# Altium project Window_Garden.PrjPcb
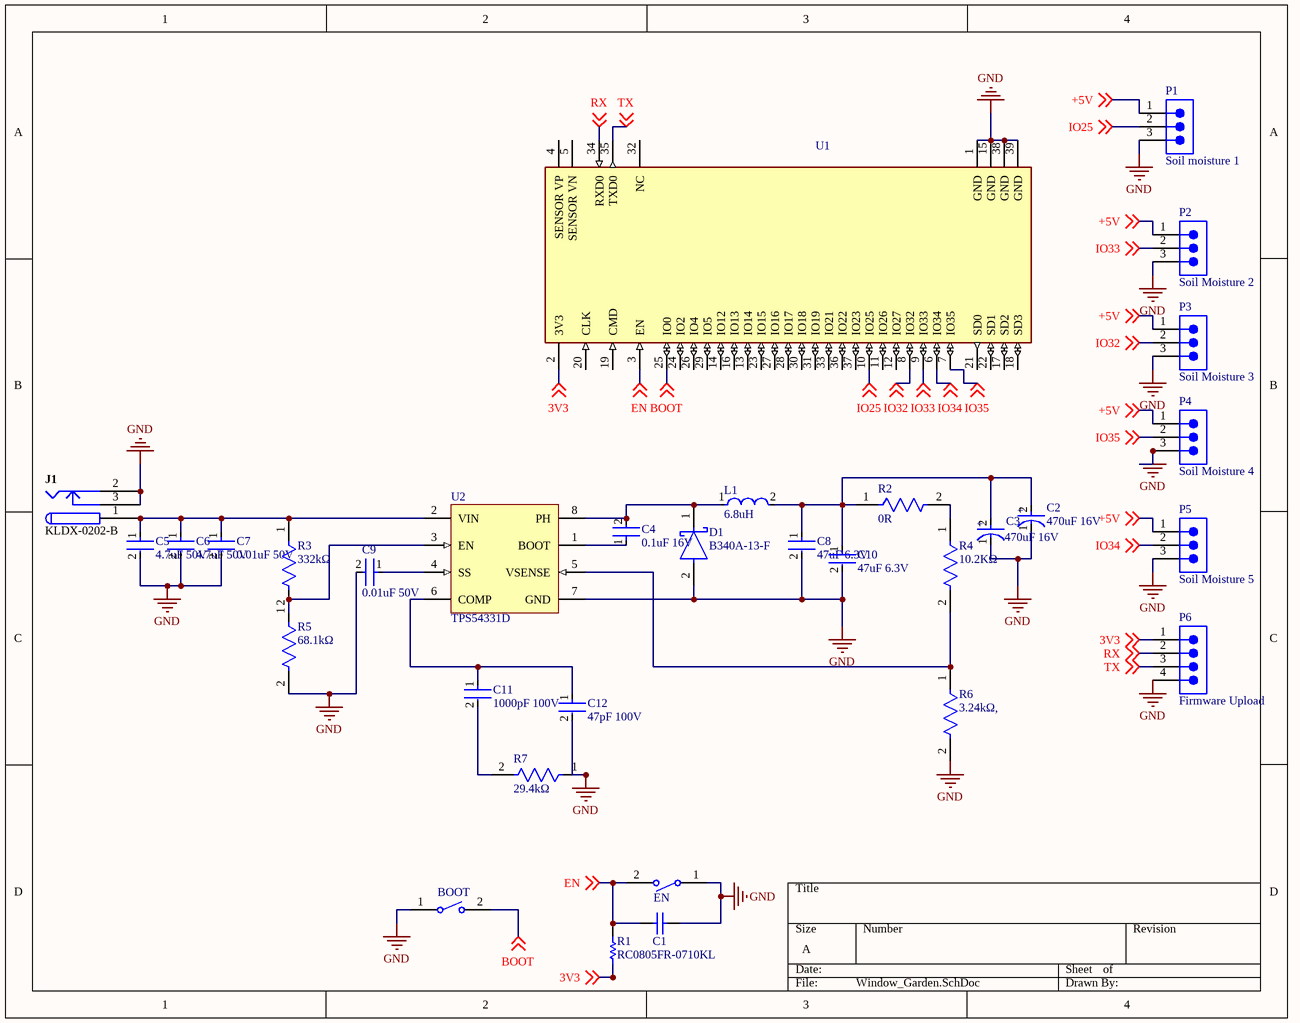
[diagram p0: Window_Garden.SchDoc]
1 sheet, 32 parts. Net scope: global (net labels, ports and power ports of the same name join across sheets).
Board file: Window_Garden.PcbDoc

## Sheet Window_Garden.SchDoc
size A; SheetNumber: 1; SheetTotal: 1

### Parts
BOOT  FSMSMTR  [TECO-FSMSMTR_V]  (value not drawn)
C1  GRM188R71H104KA93D  [CAPC1608X90X35ML10T15]  (value not drawn)
C2  470uF 16V  [FP-RAD-TH-D_8_0_5-L_11_5-MFG]
C3  470uF 16V  [FP-RAD-TH-D_8_0_5-L_11_5-MFG]
C4  0.1uF 16V  [FP-C0805C-DN-MFG]
C5  4.7uF 50V  [FP-C1206C475K5PACTU-MFG]
C6  4.7uF 50V  [FP-C1206C475K5PACTU-MFG]
C7  0.01uF 50V  [FP-C1206C-EB-MFG]
C8  47uF 6.3V  [FP-CL31-IPC_C]
C9  0.01uF 50V  [FP-C1206C-EB-MFG]
C10  47uF 6.3V  [FP-CL31-IPC_C]
C11  1000pF 100V  [FP-C0805C-DN-MFG]
C12  47pF 100V  [FP-C0805C-DN-MFG]
D1  B340A-13-F  [FP-SMA-MFG]
EN  FSMSMTR  [TECO-FSMSMTR_V]  (value not drawn)
J1  KLDX-0202-B  [KYCN-KLDX-0202-B_V]
L1  6.8uH  [FP-NR8040-H_4_2-MFG]
P1  Soil moisture 1  [691312510003]
P2  Soil Moisture 2  [691312510003]
P3  Soil Moisture 3  [691312510003]
P4  Soil Moisture 4  [691312510003]
P5  Soil Moisture 5  [691312510003]
P6  Firmware Upload  [61300411121]
R1  RC0805FR-0710KL  [RESC2013X60X35NL10T20]
R2  0R  [FP-CRCW1206-MFG]
R3  332kΩ  [FP-RMCF1206-IPC_A]
R4  10.2KΩ  [FP-RP732B-MFG]
R5  68.1kΩ  [FP-RNCP1206-MFG]
R6  3.24kΩ,  [FP-RG3216-IPC_A]
R7  29.4kΩ  [FP-MCR18-MFG]
U1  ESP32-WROOM-32D (16MB)  [FP-ESP32-WROOM-32D_16MB-MFG]  (value not drawn)
U2  TPS54331D  [D0008A_L]

### Nets
GND: BOOT.1 C1.1 C2.1(C) C3.1(C) C5.2 C6.2 C7.2 C8.2 C9.2 C10.2 C12.2 D1.2(A) EN.1 J1.2 J1.3 P1.3 P2.3 P3.3 P4.3 P5.3 P6.4 R5.2 R6.2 R7.1 U1.1(GND) U1.15(GND) U1.38(GND) U1.39(GND) U2.7(GND)
3V3: P6.1 R1.1 U1.2(3V3) ; off-sheet 3V3
+5V: P1.1 P2.1 P3.1 P4.1 P5.1 ; off-sheet +5V
BOOT: BOOT.2 U1.25(IO0) ; off-sheet BOOT
EN: C1.2 EN.2 R1.2 U1.3(EN) ; off-sheet EN
IO25: P1.2 U1.10(IO25) ; off-sheet IO25
IO32: P3.2 U1.8(IO32) ; off-sheet IO32
IO33: P2.2 U1.9(IO33) ; off-sheet IO33
IO34: P5.2 U1.6(IO34) ; off-sheet IO34
IO35: P4.2 U1.7(IO35) ; off-sheet IO35
RX: P6.2 U1.34(RXD0) ; off-sheet RX
TX: P6.3 U1.35(TXD0) ; off-sheet TX
NetC2_2: C2.2(A) C3.2(A) C8.1 C10.1 L1.2 R2.1
NetC4_1: C4.1 U2.1(BOOT)
NetC4_2: C4.2 D1.1(C) L1.1 U2.8(PH)
NetC5_1: C5.1 C6.1 C7.1 J1.1 R3.1 U2.2(VIN)
NetC9_1: C9.1 U2.4(SS)
NetC11_1: C11.1 C12.1 U2.6(COMP)
NetC11_2: C11.2 R7.2
NetR2_2: R2.2 R4.1
NetR3_2: R3.2 R5.1 U2.3(EN)
NetR4_2: R4.2 R6.1 U2.5(VSENSE)

Not connected (* = marked no-connect by the designer): U1 4(SENSOR_VP) 5(SENSOR_VN) 11(IO26) 12(IO27) 13(IO14) 14(IO12) 16(IO13) 17(SD2) 18(SD3) 19(CMD) 20(CLK) 21(SD0) 22(SD1) 23(IO15) 24(IO2) 26(IO4) 27(IO16) 28(IO17) 29(IO5) 30(IO18) 31(IO19) 32(NC) 33(IO21) 36(IO22) 37(IO23)

### Notes on the sheet
- (in symbol CMP-05427-001287-1) +

### Library data of the parts
BOOT EN = CMP-2000-07501-1: FSMSM Push Button Switch, 50 mA, -35 to 85 degC, 2-Pin SMD, RoHS, Tape and Reel; Manufacturer: TE Connectivity; Voltage Rating (DC): 24V; Electrical Life: 20000Cycles; Operating Force: 180gf; Switch Travel: 0.25mm; Contact Current Rating: 50mA; Case\/Package: SMD/SMT; Actuator Length: 1.07mm; Throw Configuration: SPST; Actuator Material: Polyamide; Contact Resistance: 100mOhm; Illumination Type: Illuminated; Max Voltage Rating (DC): 12V; Manufacturer URL: http://www.te.com/; Lead Free: LeadFree; Packaging: TapeandReel; Min Operating Temperature: -35degC; Mechanical Life: 20000Cycles; Mount: SurfaceMount; REACH SVHC: Unknown; Package Quantity: 1800; Package Reference: FSMSMTR; RoHSCompliant: true; Max Operating Temperature: 85degC; Orientation: Straight; ELV: Compliant; Datasheet URL: http://www.te.com/commerce/DocumentDelivery/DDEController?Action=showdoc&DocId=Customer+Drawing%7F1437566-3%7FC2%7Fpdf%7FEnglish%7FENG_CD_1437566-3_C2_1437566_3_1_c.dwg.pdf%7F1437566-4; Package Description: 2-Pin Surface Mount Device, Body 6 x 3.5 mm, Pitch 9.19 mm; Current Rating: 50mA; Contact Plating: Silver; Termination: GullWing; Datasheet Version: Rev. C2, 08/2014; Contact Material: Brass; Mounting Technology: SurfaceMount
C1 = CMP-2100-03643-1: Chip Capacitor, 0.1 uF, +/- 10%, 50 V, -55 to 125 degC, 0603 (1608 Metric), RoHS, Tape and Reel; Manufacturer: Murata; Dielectric Material: Ceramic; Voltage Rating: 50V; Capacitance: 100nF; Dielectric: X7R; Insulation Resistance: 10GR; Case Code (Metric): 1608; Lead Free: LeadFree; Depth: 0.8mm; Number of Pins: 2; Radiation Hardening: No; Case/Package: 0603; Manufacturer URL: http://www.murata.com/; Packaging: TapeandReel; Length: 1.6mm; Contact Plating: Tin; Datasheet URL: http://psearch.en.murata.com/capacitor/product/GRM188R71H104KA93%23.pdf; Tolerance: 10%; Case Code (Imperial): 0603; Min Operating Temperature: -55degC; RoHSCompliant: true; Voltage: 50V; Termination: SMD/SMT; Mount: SurfaceMount; Material: Ceramic; Package Quantity: 1; Height: 0.8mm; Thickness: 0.035inch; REACH SVHC: NoSVHC; Max Operating Temperature: 125degC; Width: 0.8mm; Package Reference: 0603; Voltage Rating (DC): 50V; Datasheet Version: 42675.0; Package Description: 2-Pin Surface Mount Device, Body 1.6 x 0.8 mm
C2 C3 = CMP-05427-001287-1: Aluminum Electrolytic Capacitors (Radial Lead Type) 470uF ±20% 16V; Life (Hours): 6000Hour; Lead Diameter: 0.6mm; Ripple Current: 950mA; Impedance: 56mR; Voltage Rating: 16V; Features: General Purpose; Capacitance: 470uF; Max Operating Temperature: 105°C; RoHS Compliant: Yes; Mount: Through Hole; Termination: Radial; Voltage Rating (DC): 16V; Series: FR; Case/Package: Radial; Radiation Hardening: No; Diameter: 8mm; Lead Free: Lead Free; Height - Seated (Max): 0.512inch; Lead Pitch: 5mm; Tolerance: 20%; Height: 11.5mm; ESR (Equivalent Series Resistance): 56mR; Packaging: Ammo Pack; Length: 11.5mm; Package Quantity: 1; Min Operating Temperature: -40°C; REACH SVHC: No SVHC
C4 = CMP-2007-00274-2: CAP CER 0.1UF 16V X7R 0805; Manufacturer Part Number: C0805C104K4RACTU; Manufacturer: KEMET; Material: Ceramic; Tolerance: 0.1; Capacitance: 0.10 μF; Value: 0.10 μF; Temperature Coefficient: 30ppm/°C; Device Class L3: Ceramic Capacitors; RoHS: TRUE; Octopart: https://octopart.com/c0805c104k4ractu-kemet-92155; ComponentLink2Description: Datasheet; ComponentLink2URL: https://content.kemet.com/datasheets/KEM_C1003_C0G_SMD.pdf; Temperature Range High: +125°C; Category: Cap; Lead Free: Yes; Digikey Description: CAP CER 0.1UF 16V X7R 0805; Automotive: No; Temperature Range Low: -55°C; Voltage Rating: 16 V; Package: C0805C-DN; Ipc Land Pattern Name: CAPC200125X78; Height: 0.88mm; Device Class L1: Passive Components; Temperature: -55°C to +125°C; Mouser Description: Multilayer Ceramic Capacitors MLCC - SMD/SMT 16volts 0.1uF X7R 10%; Device Class L2: Capacitors; Temperature Characteristic: X7R
C5 C6 = CMP-03020-034652-1: CAP CER 4.7UF 50V X5R 1206; Dielectric Material: Ceramic; Tolerance: 10%; Mount: Surface Mount; Number of Pins: 2; Capacitance: 4.7uF; Contact Plating: Tin; Radiation Hardening: No; Lead Free: Lead Free; Length: 3.2mm; Depth: 1.6mm; Min Operating Temperature: -55°C; Max Operating Temperature: 85°C; Voltage: 50V; Construction: Flat; Packaging: Tape and Reel; Termination: SMD/SMT; Height: 1.6mm; Voltage Rating (DC): 50V; Dielectric: X5R; Case/Package: 1206
C7 C9 = CMP-2000-06008-2: CAP CER 10000PF 50V X7R 1206; Manufacturer: KEMET; Manufacturer Part Number: C1206C103K5RACTU; Material: Ceramic; Temperature Coefficient: 15%; Capacitance: 10,000 pF; Automotive Grade: Grade 0; Value: 10,000 pF; Tolerance: 0.1; Height: 0.88mm; Digikey Description: CAP CER 10000PF 50V X7R 1206; Temperature Range Low: -55°C; Temperature: -55°C to +150°C; Temperature Range High: +150°C; Automotive: Yes; RoHS: TRUE; Lead Free: Yes; Device Class L3: Ceramic Capacitors; Device Class L2: Capacitors; Device Class L1: Passive Components; Octopart: https://octopart.com/c1206c103k5ractu-kemet-130245; Category: Cap; ComponentLink2Description: Datasheet; Mouser Description: Multilayer Ceramic Capacitors MLCC - SMD/SMT 50volts 10000pF X7R 10%; ComponentLink2URL: https://content.kemet.com/datasheets/KEM_C1007_X8R_ULTRA_150C_SMD.pdf; Voltage Rating: 50 V; Package: C1206C-EB; Temperature Characteristic: X7R; Ipc Land Pattern Name: CAPC320160X78
C8 C10 = CMP-13271-001061-1: Cap Ceramic 47uF 6.3V X5R ±20% SMD 1206 +85°C Embossed T/R; Tolerance: 20%; Capacitance: 47uF; Depth: 1.6mm; Case Code (Imperial): 1206; Voltage Rating: 6.3V; Width: 0.063inch; Max Operating Temperature: 85°C; Case/Package: 1206; Dielectric: X5R; Length: 3.2mm; Contact Plating: Tin; Height: 1.6mm; Packaging: Tape and Reel; Case Code (Metric): 3216; Voltage: 6.3V; Min Operating Temperature: -55°C; Mount: Surface Mount; Thickness: 0.071inch; Package Quantity: 1; Material: Ceramic; Radiation Hardening: No
C11 = CMP-03020-024313-1: CAP CER 1000PF 100V X7R 0805; Manufacturer Part Number: C0805C102K1RACTU; Manufacturer: KEMET; Capacitance: 1,000 pF; Value: 1,000 pF; Tolerance: 0.1; Material: Ceramic; Temperature Coefficient: 30ppm/°C; ComponentLink2URL: https://content.kemet.com/datasheets/KEM_C1003_C0G_SMD.pdf; Digikey Description: CAP CER 1000PF 100V X7R 0805; Device Class L3: Ceramic Capacitors; Automotive: No; Ipc Land Pattern Name: CAPC200125X78; Temperature: -55°C to +125°C; Lead Free: Yes; Temperature Characteristic: X7R; Device Class L2: Capacitors; Temperature Range High: +125°C; Voltage Rating: 100 V; Octopart: https://octopart.com/c0805c102k1ractu-kemet-148516; RoHS: TRUE; Mouser Description: Multilayer Ceramic Capacitors MLCC - SMD/SMT 100volts 1000pF X7R 10%; Category: Cap; ComponentLink2Description: Datasheet; Height: 0.88mm; Device Class L1: Passive Components; Temperature Range Low: -55°C; Package: C0805C-DN
C12 = CMP-1036-01631-3: CAP CER 47PF 100V 5% NP0 0805; Manufacturer: KEMET; Manufacturer Part Number: C0805C470J1GACTU; Temperature Characteristic: C0G; Material: Ceramic; Temperature Coefficient: 30ppm/°C; Tolerance: 0.05; Value: 47 pF; Device Class L3: Ceramic Capacitors; Package: C0805C-DN; Category: Cap; ComponentLink2URL: https://content.kemet.com/datasheets/KEM_C1003_C0G_SMD.pdf; Ipc Land Pattern Name: CAPC200125X78; Temperature Range Low: -55°C; Temperature: -55°C to +125°C; Temperature Range High: +125°C; Device Class L2: Capacitors; Height: 0.88mm; Octopart: https://octopart.com/c0805c470j1gactu-kemet-9138638; Digikey Description: CAP CER 47PF 100V 5% NP0 0805; Lead Free: Yes; Voltage Rating: 100 V; Device Class L1: Passive Components; Capacitance: 47 pF; Mouser Description: Capacitor: ceramic; MLCC; 47pF; 100V; C0G; ±5%; SMD; 0805; RoHS: TRUE; ComponentLink2Description: Datasheet; Automotive: No
D1 = CMP-1667-00003-3: DIODE SCHOTTKY 40V 3A SMA; Max Forward Surge Current (Ifsm): 80A; Forward Voltage: 500mV; Polarity: Standard; Max Reverse Current: 500uA; Capacitance: 250pF; Element Configuration: Single; Mount: Surface Mount; Output Current: 3A; Radiation Hardening: No; Width: 2.92mm; Current Rating: 3A; Termination: SMD/SMT; Voltage: 40V; Series: -; Max Operating Temperature: 125°C; Current: 3A; Max Repetitive Reverse Voltage (Vrrm): 40V; Min Operating Temperature: -55°C; REACH SVHC: No SVHC; Number of Pins: 2; Average Rectified Current: 3A; Contact Plating: Tin; RoHS Compliant: Yes; Max Reverse Voltage (DC): 40V; Packaging: Tape and Reel; Height: 2.3mm; Length: 4.6mm; Case/Package: SMA; Weight: 0.002258oz; Peak Non-Repetitive Surge Current: 80A; Package Quantity: 5000; Lead Free: Lead Free; Forward Current: 3A; Voltage Rating (DC): 40V
J1 = CMP-0256-00001-1: 3 Conductor Power Jack, 2 break 2 aux contacts; ComponentLink2URL: http://anacapa.kycon.com/Catalog_PDF/KLDX_0202.pdf; PackageReference: KLDX-0202-B; Contact Finish: Brass; ComponentLink2Description: Datasheet; Mounting Technology: Through Hole; PackageDescription: Jack, 9 x 14.5 mm Body, 2.5 mm Center Pin Diameter; ComponentLink1Description: Manufacturer URL; PartNumber: KLDX-0202-B; ComponentLink1URL: http://kycon.com/
L1 = CMP-14484-000783-1: Shielded Wirewound Inductor 6.8uH 30% 4.4A 32.5mΩ SMD; DC Resistance (DCR): 32.5mR; Core Material: Ferrite; Test Frequency: 100kHz; Self Resonant Frequency: 24MHz; RMS Current (Irms): 3.7A; Height: 4.2mm; RoHS Compliant: Yes; Saturation Current: 4.4A; Termination: SMD/SMT; Packaging: Tape and Reel; Lead Pitch: 5.6mm; Inductance Tolerance: 30%; Height - Seated (Max): 0.157inch; Max DC Current: 4.4A; Package Quantity: 1000; Radiation Hardening: No; Length: 8mm; Shielding: Shielded; Depth: 8.2mm; Tolerance: 30%; Current Rating: 3.7A; Resistor Type: Wirewound; Series: NRS; Halogen Free: Halogen Free; Inductance: 6.8uH; Mount: Surface Mount; Lead Free: Lead Free; Width: 0.315inch; Min Operating Temperature: -25°C; Case/Package: 8040; Max Operating Temperature: 125°C; Number of Pins: 2
P1-P5 = CMP-1502-02170-2: NexarPartId: 8917754; Gender: Male; Number of Levels: 1; Voltage: 300V; Number of Contacts: 3; Pitch: 5.08mm; Current: 20A; Color: Green; Length: 11.5mm; Height: 12mm; Contact Plating: Tin; Mount: Through Hole; Width: 15.24mm; Number of Rows: 1; Number of Pins: 3; Termination: Solder; RoHS: Compliant; Packaging: Box; REACH SVHC: Unknown; Contact Material: Brass; Lead Pitch: 5.08mm; Number of Positions Per Level: 3
P6 = CMP-1502-01064-3: NexarPartId: 32855522; Operating Supply Voltage: 250V; Pitch: 2.54mm; Contact Resistance: 20mΩ; Number of Positions: 4; Current Rating: 3A; Connector Type: Male Pin; Gender: Male; Contact Plating: Gold; Height: 8.89mm; Lead Pitch: 2.54mm; Lead Free: Lead Free; Contact Mating Length: 5.9944mm; Number of Rows: 1; Termination: Solder; Packaging: Bulk; REACH SVHC: Unknown; Min Operating Temperature: -40°C; RoHS: Compliant; Number of Contacts: 4; Voltage Rating: 250V; Color: Black; Max Operating Temperature: 105°C; Contact Material: Copper; Mount: Through Hole; Orientation: Vertical; Number of Pins: 4
R1 = CMP-1659-00013-4: Chip Resistor, 10 KOhm, +/- 1%, 0.125 W, -55 to 155 degC, 0805 (2012 Metric), RoHS, Tape and Reel; Manufacturer: Yageo; Voltage Rating: 150 V; Mount: Surface Mount; ComponentLink1Description: Manufacturer URL; ComponentLink2URL: http://www.yageo.com/documents/recent/PYu-RC_Group_51_RoHS_L_04.pdf; Pins: 2; Length: 2 mm; Min Operating Temperature: -55 degC; Height: 0.5 mm; Mounting Technology: Surface Mount; RoHSCompliant: true; REACH SVHC: No SVHC; ComponentLink1URL: http://www.yageo.com/; Max Operating Temperature: 155 degC; PackageReference: 0805; DatasheetVersion: Rev. 4, 02/2016; Package Quantity: 5000; Packaging: Tape and Reel; ComponentLink2Description: Datasheet; PackageDescription: 2-Pin Surface Mounted Device, Body 2 x 1.25 mm
R2 = CMP-00030-39388935-1: CRCW12060000ZSTA Zero Ohm Resistor, Jumper, 1206 [3216 Metric], Thick Film, 250 mW, Surface Mount; Voltage Rating (DC): 200V; Max Power Dissipation: 250mW; Temperature Coefficient: 100ppm/°C; Resistance: 0Ω; Packaging: Cut Tape; Lead Free: Contains Lead; Height: 609.6µm; Military Standard: Not; Min Operating Temperature: -55°C; Weight: 10.007382mg; Depth: 1.6mm; Termination: SMD/SMT; Mount: Surface Mount; RoHS: Compliant; Case Code (Metric): 3216; Max Operating Temperature: 155°C; NexarPartId: 39388935; Length: 3.2mm; Features: Automotive AEC-Q200; Case Code (Imperial): 1206; Composition: Thick Film; Case/Package: 1206; Voltage Rating: 200V; Width: 1.6mm; Contact Plating: Lead, Tin; Number of Terminations: 2; REACH SVHC: Unknown; Power Rating: 250mW; Radiation Hardening: No
R3 = CMP-26527-005507-1: 332kΩ ±1% 0.25W 1206 Thick Film Chip Resistor AEC-Q200 compliant; Resistance: 332kR; Temperature Coefficient: 100ppm/°C; Max Power Dissipation: 250mW; Tolerance: 1%; Case Code (Imperial): 1206; Radiation Hardening: No; RoHS Compliant: Yes; Resistor Type: Thick Film; Height: 0.028inch; Contact Plating: Tin; Case Code (Metric): 3216; Number of Terminations: 2; Length: 0.126inch; Case/Package: 1206; Min Operating Temperature: -55°C; Packaging: Tape and Reel; Max Operating Temperature: 155°C; Mount: Surface Mount; Package Quantity: 1; Width: 0.063inch; Series: RMCF; Features: Automotive AEC-Q200
R4 = CMP-03211-006303-1: Res Thin Film 1206 10.2KΩ 0.1% 0.25W 15ppm/°C Molded SMD; Manufacturer Part Number: RP73D2B10K2BTG; Manufacturer: TE Connectivity; Voltage Rating: 200V; Height: 0.65mm; Power Rating: 0.25W; Temperature: -55°C to 155°C; ComponentLink2Description: Datasheet; Resistance: 10.2KΩ; Automotive: No; ComponentLink2URL: https://www.te.com/commerce/DocumentDelivery/DDEController?Action=showdoc&DocId=Data+Sheet%7F1773272%7FL%7Fpdf%7FEnglish%7FENG_DS_1773272_L.pdf%7F8-1879255-6; Lead Free: Yes; RoHS: TRUE; Temperature Range Low: -55°C; Ipc Land Pattern Name: RESC305155X55; Temperature Coefficient: 15ppm/°C; Device Class L3: Chip SMD Resistors; Temperature Range High: 155°C; Value: 10.2KΩ; packaging: 250 cut tape length; Category: Res; Series: RP73; Octopart: https://octopart.com/rp73d2b10k2btg-te+connectivity-42013012; Device Class L1: Passive Components; Tolerance: 0.1%; Package: RP732B; octopart_url: https://octopart.com/rp73d2b10k2btg-te+connectivity-42013012; Composition: Thin Film; Device Class L2: Resistors
R5 = CMP-26527-004608-1: 68.1kΩ ±1% 0.5W 1206 High Power Anti-Sulfur Thin Film Chip Resistor; Temperature Coefficient: 100ppm/°C; Max Power Dissipation: 500mW; Resistance: 68.1kR; Number of Terminations: 2; Case/Package: 1206; Mount: Surface Mount; Max Operating Temperature: 155°C; Case Code (Metric): 3216; Height: 0.024inch; Resistor Type: Thin Film; Case Code (Imperial): 1206; Tolerance: 1%; Length: 0.122inch; Width: 0.059inch; Series: RNCP; Features: Moisture Resistant; Packaging: Cut Tape; Min Operating Temperature: -55°C; RoHS Compliant: Yes
R6 = CMP-28537-006634-1: Automotive Metal Thin Film Chip Resistor, 1206, 3.24kΩ, 0.1%, 5ppm/°C, 0.25W, 200V; Resistance: 3.24kR; Power Rating: 125mW; Max Power Dissipation: 250mW; Voltage Rating: 150V; Temperature Coefficient: 5ppm/°C; Max Operating Temperature: 155°C; Lead Free: Lead Free; Case/Package: 1206; Tolerance: 0.1%; Case Code (Metric): 3216; Series: RG; Length: 3.2mm; Min Operating Temperature: -55°C; Number of Terminations: 2; Features: Automotive AEC-Q200; Packaging: Tape and Reel; Termination: SMD/SMT; RoHS Compliant: Yes; Case Code (Imperial): 1206; Package Quantity: 5000; Voltage Rating (DC): 200V; Height: 0.4mm; Width: 1.6mm
R7 = CMP-08839-010574-1: Thick Film Chip Resistor, 1206, 29.4kΩ, 1%, 100ppm/°C, 0.25W, 200V; Resistance: 29.4kR; Max Power Dissipation: 250mW; Packaging: Tape and Reel; Length: 0.12inch; RoHS Compliant: Yes; Max Operating Temperature: 155°C; Width: 0.061inch; Resistor Type: Thick Film; Case Code (Metric): 3216; Temperature Coefficient: 100ppm/°C; Min Operating Temperature: -55°C; Voltage Rating (DC): 200V; Package Quantity: 5000; Height: 0.026inch; Case/Package: 1206; Number of Terminations: 2; Tolerance: 1%; Case Code (Imperial): 1206
U1 = CMP-194065-000022-1: RX TXRX MOD WIFI TRACE ANT SMD; Data Rate: 150Mbps; Memory Size: 536KB; Interface: I2C; Frequency: 2.5GHz; Sensitivity: -98dBm; Packaging: Tape and Reel; Min Operating Temperature: -40°C; Max Operating Temperature: 85°C; Mount: Surface Mount; Case/Package: SMD/SMT
U2 = CMP-0323-00203-3: Buck Step Down Regulator with 3.5 to 28 V Input and 0.8 to 25 V Output, -40 to 150 degC, 8-Pin SOIC (D), Green (RoHS & no Sb/Br); Manufacturer: Texas Instruments; Regulated Outputs(#): 1; Vout(Min)(V): 0.8; Iout(Max)(A): 3; Vin(Min)(V): 3.5; Rating: Catalog; SubFamily: Step-Down Regulator; Vout(Max)(V): 25; Iq(Typ)(mA): 0.11; Vin(Max)(V): 28; Duty Cycle(Max)(%): 90; ComponentLink3Description: URL Link1; ComponentLink1URL: http://www.ti.com/general/docs/lit/getliterature.tsp?genericPartNumber=TPS54331&fileType=pdf; Code_JEDEC: MS-012AA; PartNumber: TPS54331D; PackageVersion: revM, Jun-2011; ComponentLink1Description: Datasheet; PackageReference: D0008A; Eco-Plan: Green (RoHS & no Sb/Br); PackageDescription: 8-Pin Plastic Small Outline Integrated Circuit, 4.9 x 3.9 mm, Pitch 1.27 mm Pitch; ComponentLink2URL: http://www.ti.com/litv/pdf/msoi002j; DatasheetVersion: SLVS839D; Topology: Buck; Switch Current Limit(Typ)(A): 3.5; ComponentLink3URL: Samples URL:http://www.ti.com/product/tps54331#samples; ComponentLink2Description: Package Specification; Mounting Technology: Surface Mount